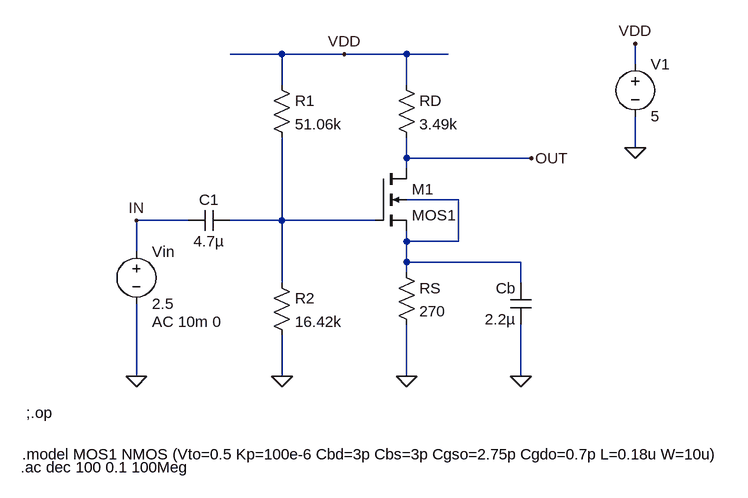
[diagram p0: schematic common_source_AC.asc]
common_source_AC.asc, the LTspice schematic file:
Version 4
SHEET 1 880 680
WIRE -48 -96 -128 -96
WIRE 48 -96 -48 -96
WIRE 144 -96 48 -96
WIRE 208 -96 144 -96
WIRE 496 -80 496 -112
WIRE -48 -48 -48 -96
WIRE 144 -48 144 -96
WIRE 496 48 496 0
WIRE 144 64 144 32
WIRE 336 64 144 64
WIRE 144 80 144 64
WIRE 224 128 144 128
WIRE -192 160 -272 160
WIRE -48 160 -48 32
WIRE -48 160 -128 160
WIRE 96 160 -48 160
WIRE 144 192 144 176
WIRE 224 192 224 128
WIRE 224 192 144 192
WIRE -272 208 -272 160
WIRE 144 224 144 192
WIRE 320 224 144 224
WIRE 144 240 144 224
WIRE -48 256 -48 160
WIRE 320 256 320 224
WIRE -272 400 -272 288
WIRE -48 400 -48 336
WIRE 144 400 144 320
WIRE 320 400 320 320
FLAG 144 400 0
FLAG -48 400 0
FLAG 48 -96 VDD
FLAG 320 400 0
FLAG 496 -112 VDD
FLAG 496 48 0
FLAG 336 64 OUT
FLAG -272 160 IN
FLAG -272 400 0
SYMBOL nmos4 96 80 R0
SYMATTR InstName M1
SYMATTR Value MOS1
SYMBOL res 128 224 R0
SYMATTR InstName RS
SYMATTR Value 270
SYMBOL res 128 -64 R0
SYMATTR InstName RD
SYMATTR Value 3.49k
SYMBOL res -64 -64 R0
SYMATTR InstName R1
SYMATTR Value 51.06k
SYMBOL res -64 240 R0
SYMATTR InstName R2
SYMATTR Value 16.42k
SYMBOL cap -128 144 R90
WINDOW 0 0 32 VBottom 2
WINDOW 3 32 32 VTop 2
SYMATTR InstName C1
SYMATTR Value 4.7µ
SYMBOL cap 336 320 R180
WINDOW 0 24 56 Left 2
WINDOW 3 24 8 Left 2
SYMATTR InstName Cb
SYMATTR Value 2.2µ
SYMBOL voltage 496 -96 R0
WINDOW 123 0 0 Left 0
WINDOW 39 0 0 Left 0
SYMATTR InstName V1
SYMATTR Value 5
SYMBOL voltage -272 192 R0
WINDOW 123 24 124 Left 2
WINDOW 39 0 0 Left 0
SYMATTR InstName Vin
SYMATTR Value 2.5
SYMATTR Value2 AC 10m 0
TEXT -442 456 Left 2 !;.op
TEXT -448 520 Left 2 !.model MOS1 NMOS (Vto=0.5 Kp=100e-6 Cbd=3p Cbs=3p Cgso=2.75p Cgdo=0.7p L=0.18u W=10u)
TEXT -450 540 Left 2 !.ac dec 100 0.1 100Meg

The netlist it stands for:
* common_source_AC.asc
M1 OUT N002 N001 N001 MOS1
RS N001 0 270
RD VDD OUT 3.49k
R1 VDD N002 51.06k
R2 N002 0 16.42k
C1 N002 IN 4.7µ
Cb 0 N001 2.2µ
V1 VDD 0 5
Vin IN 0 2.5 AC 10m 0
.model NMOS NMOS
.model PMOS PMOS
.lib standard.mos
;.op
.model MOS1 NMOS (Vto=0.5 Kp=100e-6 Cbd=3p Cbs=3p Cgso=2.75p Cgdo=0.7p L=0.18u W=10u)
.ac dec 100 0.1 100Meg
.backanno
.end